# Altium schematic sheet Light source driver board circuit diagram.SchDoc
size B; SheetNumber: 0; SheetTotal: 0
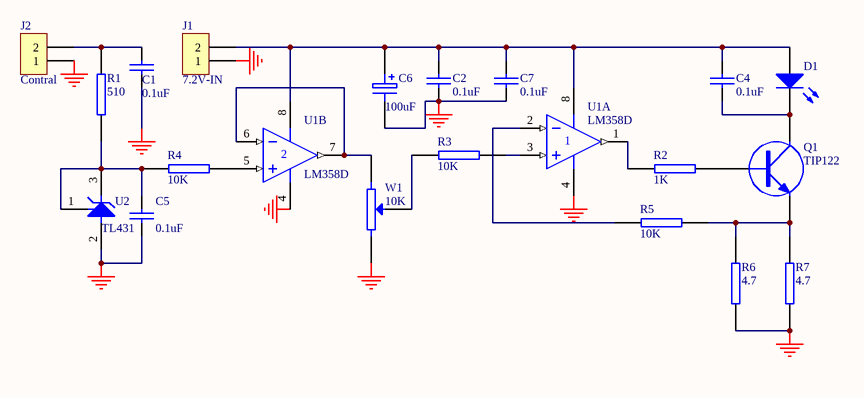
[diagram p0: Light source driver board circuit diagram.SchDoc]

## Parts
C1  0.1uF  [0805]
C2  0.1uF  [0805]
C4  0.1uF  [0805]
C5  0.1uF  [0805]
C6  100uF  [7243]
C7  0.1uF  [0805]
D1  (no value)  [LED-1]
J1  7.2V-IN  [XH2.54-2P_直]
J2  Contral  [XH2.54-2P_直]
Q1  TIP122  [TO220H]
R1  510  [0805]
R2  1K  [0805]
R3  10K  [0805]
R4  10K  [0805]
R5  10K  [0805]
R6  4.7  [1210]
R7  4.7  [1210]
U1  LM358D  [SO-8]  (parts A,B of 2)
U2  TL431  [SOT-89_M]
W1  10K  [VR]

## Nets
GND: C1.1 C2.2 C5.1 C6.2 C7.2 J1.1 J2.1 R6.2 R7.2 U1.4(V-) U2.2(A) W1.2
NetC1_2: C1.2 J2.2 R1.1
NetC2_1: C2.1 C4.1 C6.1 C7.1 D1.1(A) J1.2 U1.8(V+)
NetC4_2: C4.2 D1.2(K) Q1.2(C)
NetC5_2: C5.2 R1.2 R4.1 U2.1(R) U2.3(K)
NetQ1_1: Q1.1(B) R2.2
NetQ1_3: Q1.3(E) R5.1 R6.1 R7.1
NetR2_1: R2.1 U1.1(OUT)
NetR3_1: R3.1 W1.3(W)
NetR3_2: R3.2 U1.3(IN+)
NetR4_2: R4.2 U1.5(IN+)
NetR5_2: R5.2 U1.2(IN-)
NetU1_6: U1.6(IN-) U1.7(OUT) W1.1

## Library data of the parts
C1 C2 C4 C5 C7 = CAP: Capacitor
C6 = ELECTRO1: Electrolytic Capacitor
D1 = LED1: Typical RED GaAs LED; Published: 8-Jun-2000; LatestRevisionDate: 08-Jul-2005; LatestRevisionNote: Mech Layer 1 removed.; PackageReference: LED-1; Publisher: Altium Limited; PackageDescription: LED; 2 Leads
J1 J2 = CON2: Connector
Q1 = NPN: NPN Transistor
R1-R7 = RES2
U1 = LM358D: Dual Low-Power Operational Amplifier; Published: 17-Jul-2002; LatestRevisionDate: 13-Apr-2006; LatestRevisionNote: IPC-7351 Footprint Added.; DatasheetVersion: 1988; PackageReference: 751-02; Publisher: Altium Limited; PackageDescription: 8-Pin Small Outline Integrated Circuit 1.27 mm Pitch; Code_JEDEC: MS-012-AA; Code_IPC: SOIC127P600-8; ComponentLink1Description: Manufacturer Link; ComponentLink1URL: http://www.onsemi.com/site/products/parametrics/0,4446,251,00.html; ComponentLink2Description: Datasheet; ComponentLink2URL: http://www.onsemi.com/pub/Collateral/LM358-D.PDF
U2 = TL431: Adjustable Precision Shunt Regulator
W1 = POT2: Potentiometer